# EAGLE schematic wiring_harnesses (EAGLE 6.6.0)
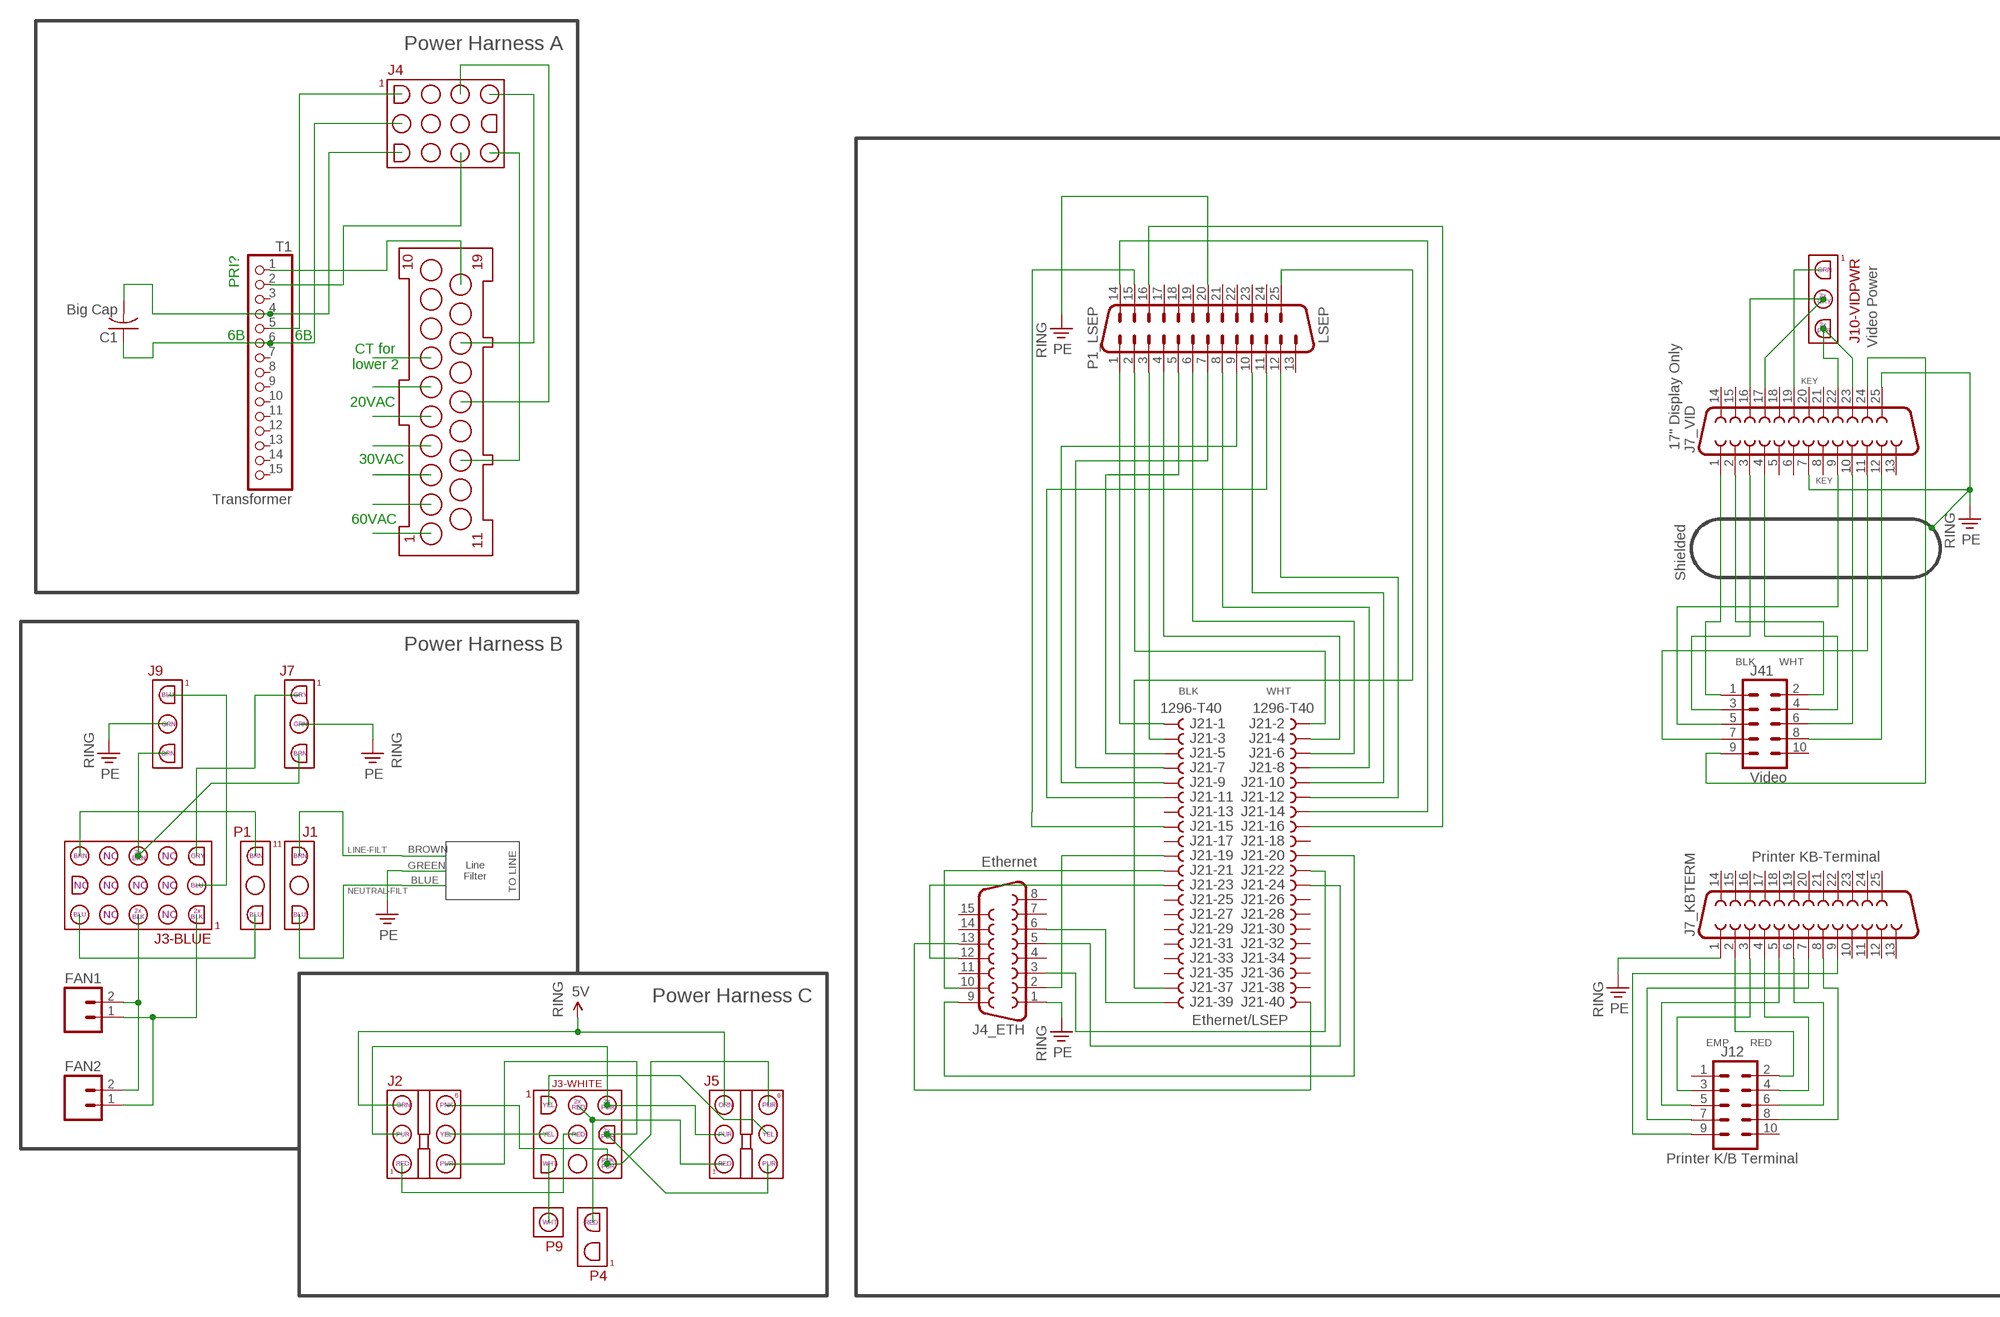
[diagram p0: schematic, sheet 1, part 1 of 2]
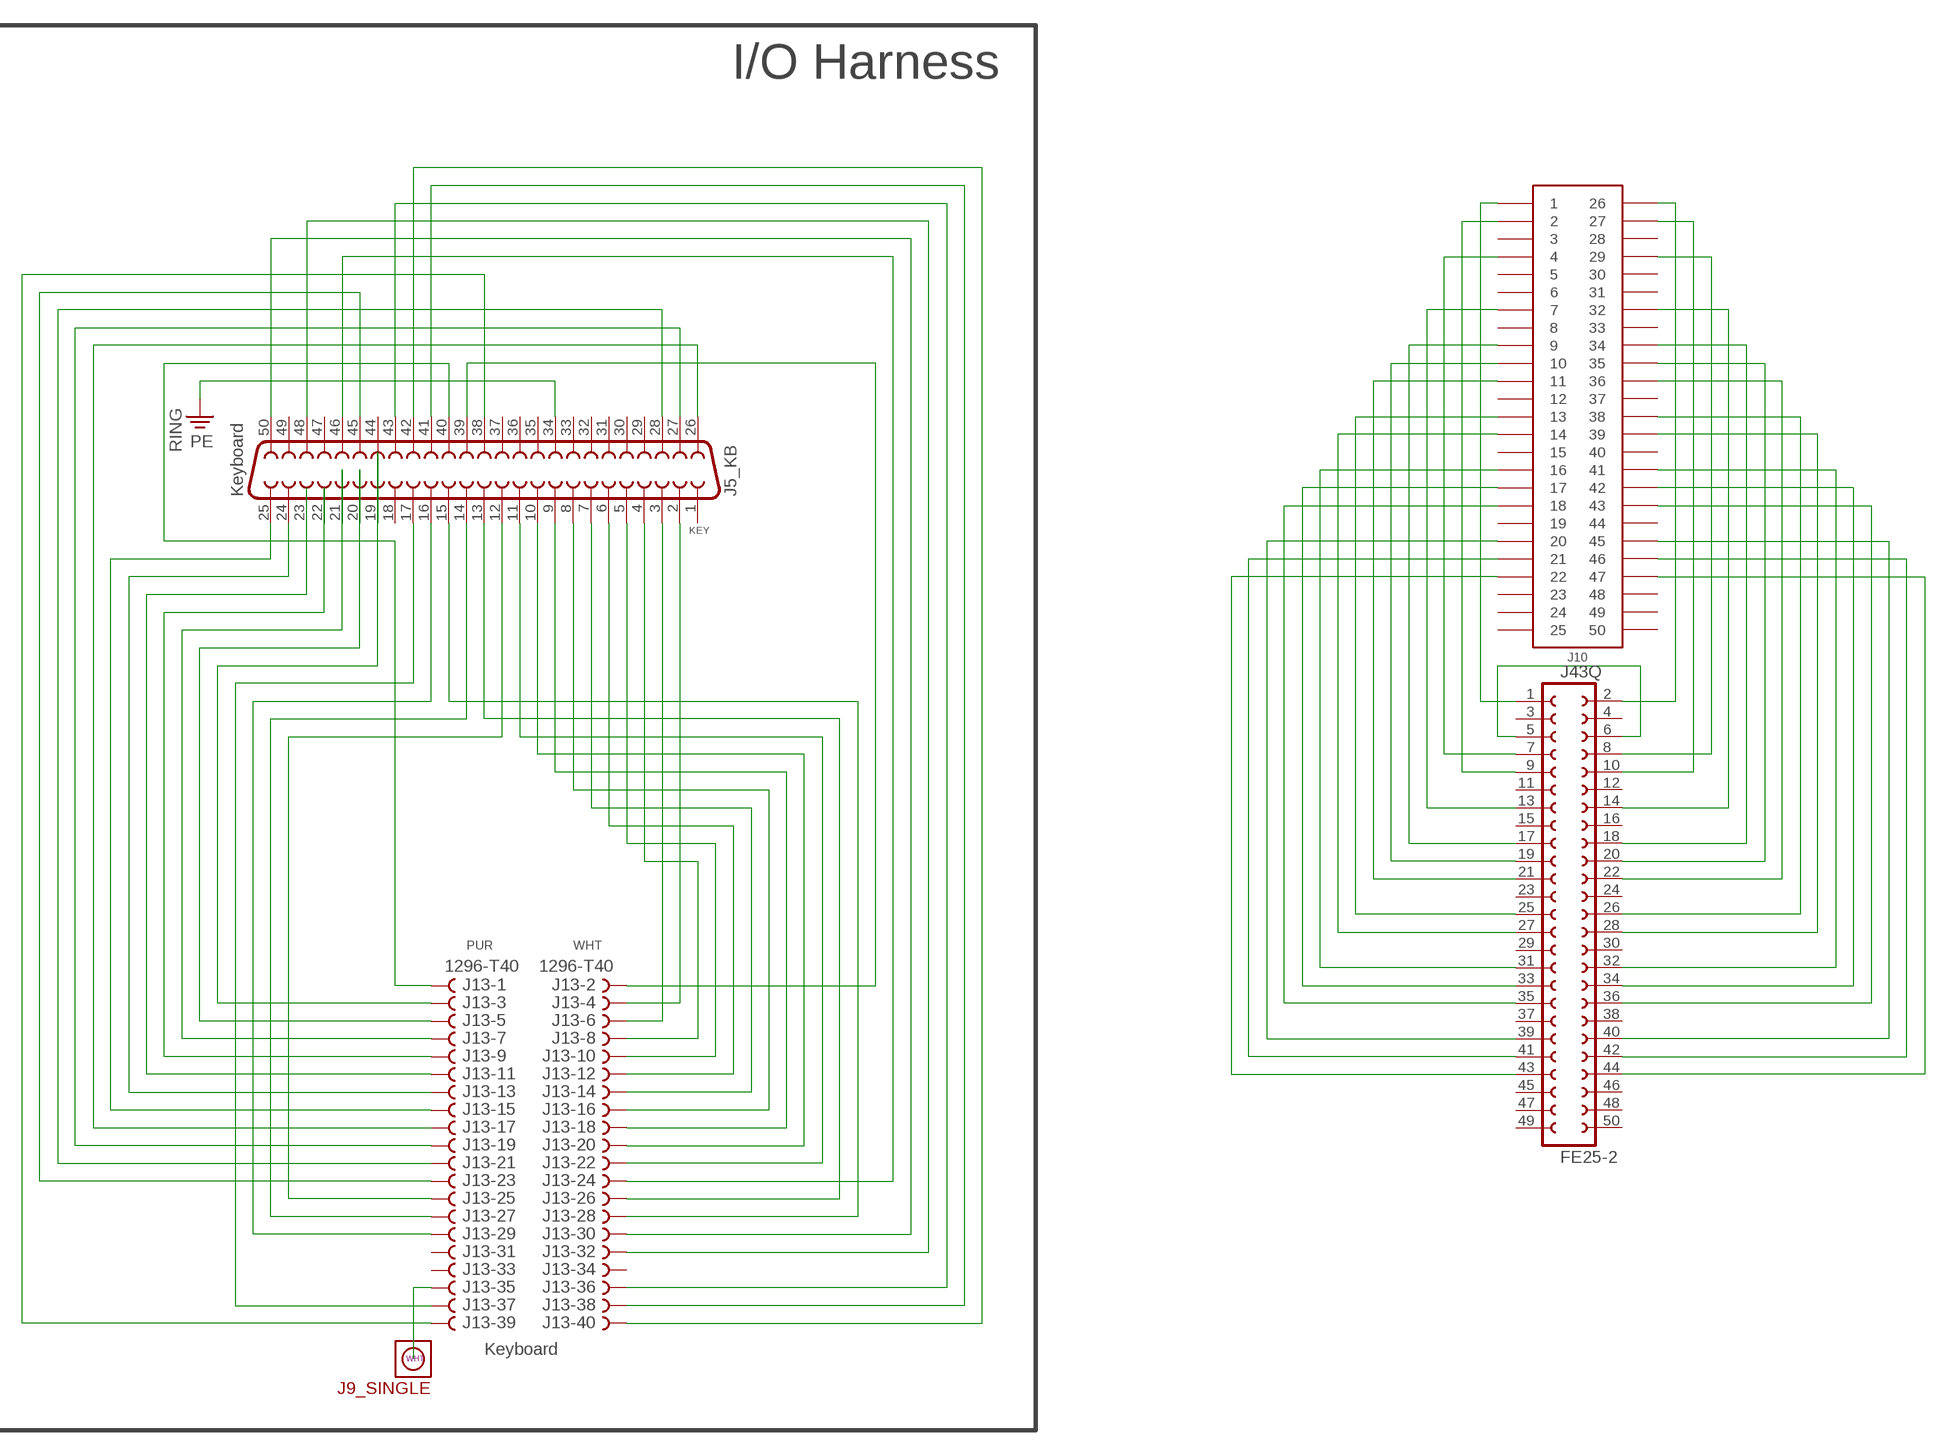
[diagram p1: schematic, sheet 1, part 2 of 2]

## Parts
C1  Big Cap  C-US275-173X316  [C275-173X316]
FAN1  M02POGO_PIN_HOLES_ONLY  [1X02_PP_HOLES_ONLY]
FAN2  M02POGO_PIN_HOLES_ONLY  [1X02_PP_HOLES_ONLY]
J1  MOLEX-MLX3X1  [MOLEX-MLX3X1]
J2  AMP-MATENLOK-3X2  [MATENLOK-3X2]
J3-BLUE  MOLEX-MLX3X5  [MOLEX-MLX3X5]
J3-WHITE  MOLEX-MLX3X3  [MOLEX-MLX3X3]
J4  MOLEX-MLX3X4  [MOLEX-MLX3X4]
J4_ETH  Ethernet  F15D  [F15D]
J5  AMP-MATENLOK-3X2  [MATENLOK-3X2]
J5_KB  Keyboard  F50VP  [F50VP]
J7  MOLEX-MLX3X1  [MOLEX-MLX3X1]
J7_KBTERM  Printer KB-Terminal  F25VP  [F25VP]
J7_VID  17" Display Only  F25VP  [F25VP]
J9  MOLEX-MLX3X1  [MOLEX-MLX3X1]
J9_SINGLE  MOLEX-MLX1X1  [MOLEX-MLX1X1]
J10  EDGECON-F-0.1-50  [EDGECON-M-0.1-50]
J10-VIDPWR  Video Power  MOLEX-MLX3X1  [MOLEX-MLX3X1]
J12  Printer K/B Terminal  M05X2NO_SILK  [2X5_NOSILK]
J13  1296-T40  [1296-40]
J21  1296-T40  [1296-40]
J41  Video  M05X2NO_SILK  [2X5_NOSILK]
J43Q  FE25-2  [MA25-2]
P1  MOLEX-MLX3X1  [MOLEX-MLX3X1]
P1_LSEP  LSEP  DB25VP  [M25VP]
P4  MOLEX-MLX2X1  [MOLEX-MLX2X1]
P9  MOLEX-MLX1X1  [MOLEX-MLX1X1]
PSUCONN  AMP-METRIMATE-19  [AMP-METRIMATE-19]
T1  Transformer  PINHD-1X15  [1X15]

## Nets
5V: J2.5 J5.5
LINE: J3-BLUE.1 P1.1
LINE-FILT: J1.1
N$1: PSUCONN.13
N$2: PSUCONN.17
N$3: PSUCONN.15
N$4: PSUCONN.19 T1.1
N$5: T1.2
N$6: PSUCONN.1
N$7: C1.2 T1.4
N$8: C1.1 T1.6
N$9: PSUCONN.2
N$10: T1.5
N$11: PSUCONN.3
N$12: PSUCONN.4
N$13: PSUCONN.5
N$14: PSUCONN.6
N$15: PSUCONN.7
N$18: FAN1.2 FAN2.2 J3-BLUE.9
N$19: FAN1.1 FAN2.1 J3-BLUE.15
N$20: J3-BLUE.14 J9.1
N$21: J3-BLUE.7 J7.3 J9.3
N$22: J3-BLUE.13 J7.1
N$23: J2.4 J3-WHITE.2
N$24: J2.6 J3-WHITE.9 J5.6
N$25: J2.2 J3-WHITE.8 J5.2
N$26: J2.3 J3-WHITE.7 J5.3
N$27: J3-WHITE.4 J5.1 P4.2
N$28: J2.1 J3-WHITE.5
N$29: J3-WHITE.1 J5.4
N$30: J3-WHITE.3 P9.1
N$31: J43Q.5 J43Q.6
N$32: J10.26 J43Q.2
N$33: J10.29 J43Q.8
N$34: J10.27 J43Q.10
N$35: J10.32 J43Q.14
N$36: J10.34 J43Q.18
N$37: J10.35 J43Q.20
N$38: J10.36 J43Q.22
N$39: J10.38 J43Q.26
N$40: J10.39 J43Q.28
N$41: J10.41 J43Q.32
N$42: J10.1 J43Q.1
N$43: J10.43 J43Q.36
N$44: J10.45 J43Q.40
N$45: J10.46 J43Q.42
N$46: J10.47 J43Q.44
N$47: J10.42 J43Q.34
N$48: J10.2 J43Q.9
N$49: J10.4 J43Q.7
N$50: J10.7 J43Q.13
N$51: J10.9 J43Q.17
N$52: J10.10 J43Q.19
N$53: J10.11 J43Q.21
N$54: J10.13 J43Q.25
N$55: J10.14 J43Q.27
N$56: J10.16 J43Q.31
N$57: J10.17 J43Q.33
N$58: J10.18 J43Q.35
N$59: J10.20 J43Q.39
N$60: J10.21 J43Q.41
N$61: J10.22 J43Q.43
N$62: J4_ETH.3 J21.22
N$63: J4_ETH.2 J21.19
N$64: J4_ETH.5 J21.24
N$65: J4_ETH.6 J21.39
N$66: J4_ETH.9 J21.20
N$67: J4_ETH.10 J21.21
N$68: J4_ETH.12 J21.23
N$69: J4_ETH.13 J21.40
N$70: J21.37 P1_LSEP.25
N$71: J21.1 P1_LSEP.1
N$72: J21.2 P1_LSEP.2
N$73: J21.3 P1_LSEP.3
N$74: J21.4 P1_LSEP.4
N$75: J21.5 P1_LSEP.5
N$76: J21.6 P1_LSEP.6
N$77: J21.7 P1_LSEP.7
N$78: J21.8 P1_LSEP.8
N$79: J21.9 P1_LSEP.9
N$80: J21.10 P1_LSEP.10
N$81: J21.11 P1_LSEP.11
N$82: J21.12 P1_LSEP.12
N$83: J21.14 P1_LSEP.14
N$84: J21.15 P1_LSEP.15
N$85: J21.16 P1_LSEP.16
N$86: J7_KBTERM.2 J12.2
N$87: J7_KBTERM.3 J12.3
N$88: J7_KBTERM.4 J12.4
N$89: J7_KBTERM.5 J12.5
N$90: J7_KBTERM.6 J12.6
N$91: J7_KBTERM.7 J12.7
N$92: J7_KBTERM.8 J12.8
N$93: J7_KBTERM.9 J12.9
N$94: J7_VID.1 J41.1
N$95: J7_VID.2 J41.2
N$96: J7_VID.3 J41.3
N$97: J7_VID.4 J41.4
N$98: J7_VID.9 J41.5
N$99: J7_VID.10 J41.6
N$100: J7_VID.16 J7_VID.17 J10-VIDPWR.2
N$101: J7_VID.19 J10-VIDPWR.1
N$102: J7_VID.11 J41.7
N$103: J7_VID.12 J41.8
N$104: J7_VID.22 J7_VID.23 J10-VIDPWR.3
N$105: J7_VID.24 J41.9
N$106: J5_KB.2 J13.4
N$107: J5_KB.3 J13.6
N$108: J5_KB.4 J13.8
N$109: J5_KB.5 J13.10
N$110: J5_KB.6 J13.12
N$111: J5_KB.7 J13.14
N$112: J5_KB.8 J13.16
N$113: J5_KB.9 J13.18
N$114: J5_KB.10 J13.20
N$115: J5_KB.11 J13.22
N$116: J5_KB.12 J13.25
N$117: J5_KB.13 J13.26
N$118: J5_KB.14 J13.27
N$119: J5_KB.15 J13.28
N$120: J5_KB.16 J13.29
N$121: J5_KB.17 J13.37
N$122: J5_KB.23 J13.11
N$123: J5_KB.19 J13.3
N$124: J5_KB.20 J13.5
N$125: J5_KB.21 J13.7
N$126: J5_KB.22 J13.9
N$127: J5_KB.24 J13.13
N$128: J5_KB.25 J13.15
N$129: J5_KB.26 J13.17
N$130: J5_KB.27 J13.19
N$131: J5_KB.28 J13.21
N$132: J5_KB.45 J13.23
N$133: J5_KB.38 J13.39
N$134: J9_SINGLE.1 J13.35
N$135: J5_KB.40 J13.1
N$136: J5_KB.39 J13.2
N$137: J5_KB.42 J13.40
N$138: J5_KB.41 J13.38
N$139: J5_KB.43 J13.36
N$140: J5_KB.48 J13.32
N$141: J5_KB.50 J13.30
N$142: J5_KB.46 J13.24
NEUTRAL: J3-BLUE.3 P1.3
NEUTRAL-FILT: J1.3
PE: J4_ETH.1 J5_KB.34 J7.2 J7_KBTERM.1 J7_VID.7 J7_VID.25 J9.2 P1_LSEP.20
Unconnected: J1.2 J3-BLUE.2 J3-BLUE.4 J3-BLUE.5 J3-BLUE.6 J3-BLUE.8 J3-BLUE.10 J3-BLUE.11 J3-BLUE.12 J3-WHITE.6 J4.1 J4.2 J4.3 J4.4 J4.5 J4.6 J4.7 J4.8 J4.9 J4.10 J4.11 J4.12 J4_ETH.4 J4_ETH.7 J4_ETH.8 J4_ETH.11 J4_ETH.14 J4_ETH.15 J5_KB.1 J5_KB.18 J5_KB.29 J5_KB.30 J5_KB.31 J5_KB.32 J5_KB.33 J5_KB.35 J5_KB.36 J5_KB.37 J5_KB.44 J5_KB.47 J5_KB.49 J7_KBTERM.10 J7_KBTERM.11 J7_KBTERM.12 J7_KBTERM.13 J7_KBTERM.14 J7_KBTERM.15 J7_KBTERM.16 J7_KBTERM.17 J7_KBTERM.18 J7_KBTERM.19 J7_KBTERM.20 J7_KBTERM.21 J7_KBTERM.22 J7_KBTERM.23 J7_KBTERM.24 J7_KBTERM.25 J7_VID.5 J7_VID.6 J7_VID.8 J7_VID.13 J7_VID.14 J7_VID.15 J7_VID.18 J7_VID.20 J7_VID.21 J10.3 J10.5 J10.6 J10.8 J10.12 J10.15 J10.19 J10.23 J10.24 J10.25 J10.28 J10.30 J10.31 J10.33 J10.37 J10.40 J10.44 J10.48 J10.49 J10.50 J12.1 J12.10 J13.31 J13.33 J13.34 J21.13 J21.17 J21.18 J21.25 J21.26 J21.27 J21.28 J21.29 J21.30 J21.31 J21.32 J21.33 J21.34 J21.35 J21.36 J21.38 J41.10 J43Q.3 J43Q.4 J43Q.11 J43Q.12 J43Q.15 J43Q.16 J43Q.23 J43Q.24 J43Q.29 J43Q.30 J43Q.37 J43Q.38 J43Q.45 J43Q.46 J43Q.47 J43Q.48 J43Q.49 J43Q.50 P1.2 P1_LSEP.13 P1_LSEP.17 P1_LSEP.18 P1_LSEP.19 P1_LSEP.21 P1_LSEP.22 P1_LSEP.23 P1_LSEP.24 P4.1 PSUCONN.8 PSUCONN.9 PSUCONN.10 PSUCONN.11 PSUCONN.12 PSUCONN.14 PSUCONN.16 PSUCONN.18 T1.3 T1.7 T1.8 T1.9 T1.10 T1.11 T1.12 T1.13 T1.14 T1.15

## Notes on the sheet
- Power Harness A
- I/O Harness
- PRI? | ORN
- 2x
- GRY
- 2x
- PUR
- 6B | 6B
- Video Power
- CT for
  lower 2
- RING
- KEY
- 20VAC
- 30VAC
- KEY
- RING
- 60VAC
- RING
- KEY
- Shielded
- Power Harness B
- BLK | WHT
- BLK | WHT
- BLU | GRY
- GRN | GRN
- BRN | BRN
- RING | RING
- 2x | BROWN
- BRN | NC | NC | GRY | BRN | BRN
- BRN
- GREEN
- Line
  Filter
- BLUE
- NC | NC | NC | NC | BLU
- TO LINE
- PUR | WHT
- 2x | 2x
- BLU | NC | NC | BLU | BLU
- BLK | BLK
- Power Harness C
- RING | Ethernet/LSEP | RING
- EMP | RED
- RING
- 2x | 2x
- ORN | PNK | YEL | ORN | PUR
- RED | PUR
- 2x
- PUR | YEL | YEL | RED | PUR | YEL
- PUR
- PNK
- RED | PUR | WHT | RED | PUR
- PUR
- RED
- WHT
- Keyboard
- WHT

## Library data of the parts
C1 = resistor:C-US: CAPACITOR, American symbol
FAN1 FAN2 = SparkFun-Connectors:M02: Standard 2-pin 0.1" header. Use with - straight break away headers ( PRT-00116) - right angle break away headers (PRT-00553) - swiss pins (PRT-00743) - machine pins (PRT-00117) - female headers (PRT-00115) Molex polarized connector foot print use with: PRT-08233 with associated crimp pins and housings. 2.54_SCREWTERM for use with PRT-10571. 3.5mm Screw Terminal footprints for PRT-08084 5mm Screw Terminal footprints for use with PRT-08433
J1 J7 J9 J10-VIDPWR P1 = con-sen:MOLEX-MLX3X1
J2 J5 = con-sen:AMP-MATENLOK-3X2
J3-BLUE = con-sen:MOLEX-MLX3X5
J3-WHITE = con-sen:MOLEX-MLX3X3
J4 = con-sen:MOLEX-MLX3X4
J4_ETH = con-subd:F15: SUB-D; OC_FARNELL: unknown; OC_NEWARK: unknown
J5_KB = con-subd:F50: SUB-D; OC_FARNELL: unknown; OC_NEWARK: unknown
J7_KBTERM J7_VID = SparkFun-Connectors:F25: 25 Pin male connector. PCB edge mount for regular PCB thicknesses. This connector will connect directly to the back of a PC parallel port or through a normal DB25 extension cable (M/F). SKU: PRT-08287
J9_SINGLE P9 = con-sen:MOLEX-MLX1X1
J10 = con-sen:EDGECON-F-0.1-50
J12 J41 = SparkFun-Connectors:M05X2: Header 5x2 Standard 10-pin dual row 0.1" header. Commonly used with AVR-ISP. Use with Spark Fun Electronics SKU: PRT-00778
J13 J21 = con-leotronics:1296-T40: 1.27mm SINGLE ROW FEMALE SOCKET Source: http://www.leotronics.co.uk/Conexcon/Data%20Sheets/sec.%20A/1296ing.pdf; OC_FARNELL: unknown; OC_NEWARK: unknown
J43Q = con-sen:FE25-2
P1_LSEP = SparkFun-Connectors:DB25: Various DB25 connectors
P4 = con-sen:MOLEX-MLX2X1
PSUCONN = con-sen:AMP-METRIMATE-19
T1 = pinhead:PINHD-1X15: PIN HEADER